# EAGLE design tweeq-BATT_CR1220 (EAGLE 7.2.0)
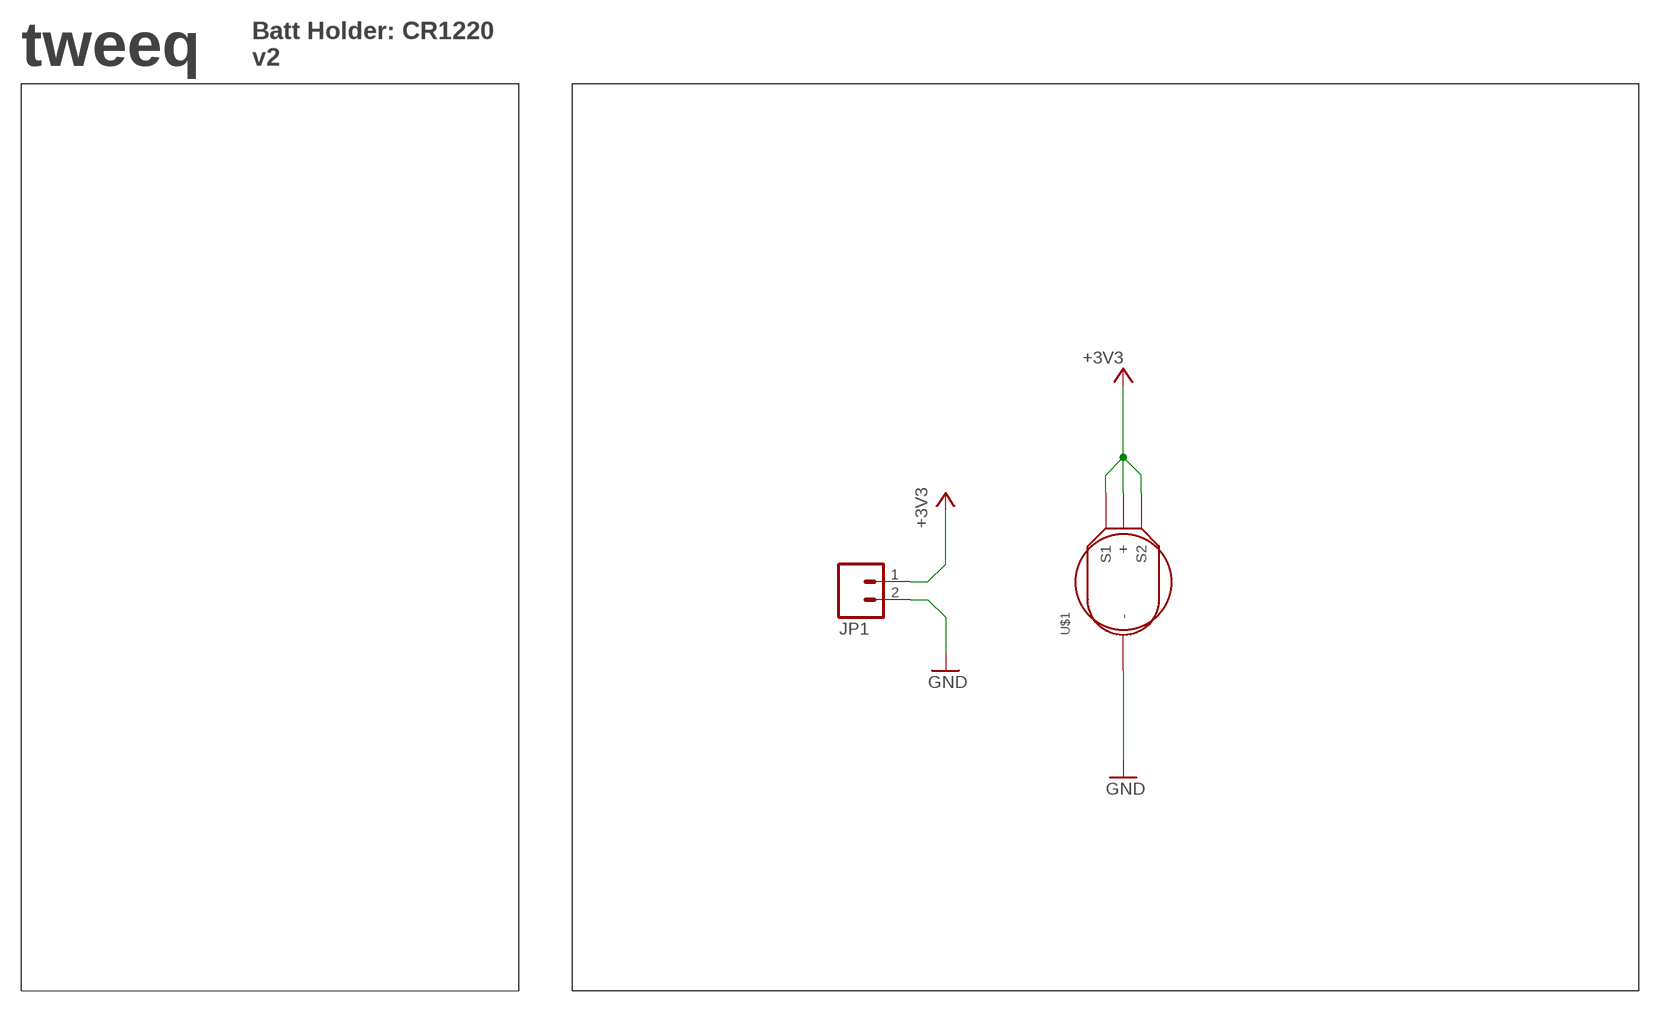
[diagram p0: schematic, sheet 1]

## Parts
JP1  M02/SMD_POL  [1X02_SMD_POL]
U$1  BATT_HOLDER-CC/CR1220_TH  [CR1220_TH]

## Nets
+3V3: JP1.1 U$1.+1(+) U$1.+2(S2) U$1.P$1(S1)
GND: JP1.2 U$1.-

## Notes on the sheet
- tweeq
- Batt Holder: CR1220
  v2

## Library data of the parts
JP1 = AISCube:M02: Header 2 Standard 2-pin 0.1" header. Use with straight break away headers (SKU : PRT-00116), right angle break away headers (PRT-00553), swiss pins (PRT-00743), machine pins (PRT-00117), and female headers (PRT-00115). Molex polarized connector foot print use with SKU : PRT-08233 with associated crimp pins and housings.
U$1 = AISCube:BATT_HOLDER-CC

## Board
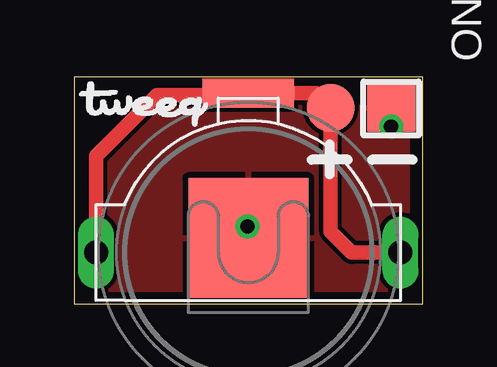
[diagram p1: board, top side]
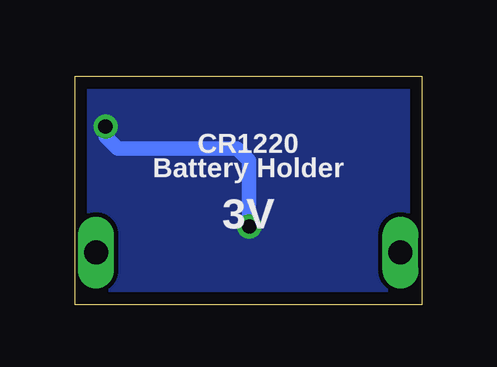
[diagram p2: board, bottom side, seen from below]

Size 14.5 x 9.5 mm. Coordinates in mm from the lower left corner, seen from the top.
Outline: 0,9.5 14.5,9.5 14.5,0 0,0 0,9.5
Copper layers (1*16): Top 0.0356mm / dielectric 1.5011mm / Bottom 0.0356mm
Design rules "AISCube": minimum track width 7mil, minimum drill 14mil, track to track 7mil, track to pad 7mil, pad to pad 7mil, via to via 7mil, smd to smd 0mil, copper to edge 20mil, drill to drill 8mil, minimum pad ring 10mil, minimum via ring 8mil, stop-mask expansion 4mil, vias tented up to drill 32mil, thermal gap 10mil

### Footprints (pad centres in the part's own frame; a part is rotated, then mirrored left to right if it is on the bottom)
1X02_SMD_POL = smd 2 x 2: 1 -1.27,0; 2 1.27,0
CR1220_TH = drill 1 long: +1 -6.35,0; +2 6.35,0 | smd 5 x 5: - 0,0.6 | smd 3.81 x 1.2: P$1 0,6.65

### Placement (x,y rotation side)
JP1  11.95,8.2 0 top
U$1  7.25,2.16 0 top
U$2  [TWEEQ-LOGO-S]  0.2,7.42 0 top

### Tracks (layer width: path | path; a pad name or v marks a point on that pad's centre or on a via)
+3V3
  Top 0.61: U$1.+1 0.9,6.18 3.45,8.74 7.17,8.74 U$1.P$1 10.07,8.81 JP1.1 10.68,3.03 11.55,2.16 U$1.+2
GND  (via drill 0.6)
  Top 0.61: U$1.- 7.21,2.8 v7.21,3.25 | v13.21,7.42 13.21,8.19 JP1.2
  Bottom 0.61: v7.21,3.25 7.21,5.99 7.72,6.5 12.7,6.5 13.21,7.01 v13.21,7.42
  pour Top: 14.3,9.3 14.3,0.18 0.15,0.18 0.15,9.3
  pour Bottom: 14.3,0.18 14.3,9.3 0.15,9.3 0.15,0.18

### Text on the board
bPlace: CR1220 | Battery Holder | 3V
tNames: 6V-9V DC | ON
bNames: Breadboard | V-Reg | Module